# Altium schematic sheet COMSXXXX_Beacon_Rework.SchDoc: BLUEsat Beacon
size A3; Author: Daniel Jedrychowski; Engineer: D. JEDRYCHOWSKI; Organization: BLUEsat Project; Address1: Room 419; Address2: School of EE&T; Address3: UNSW, NSW 2052; Address4: Australia; DocumentNumber: COMS0001; SheetNumber: 1; SheetTotal: 1; Description: Morse code continuous wave beacon based on EPROM; Version: 1.1
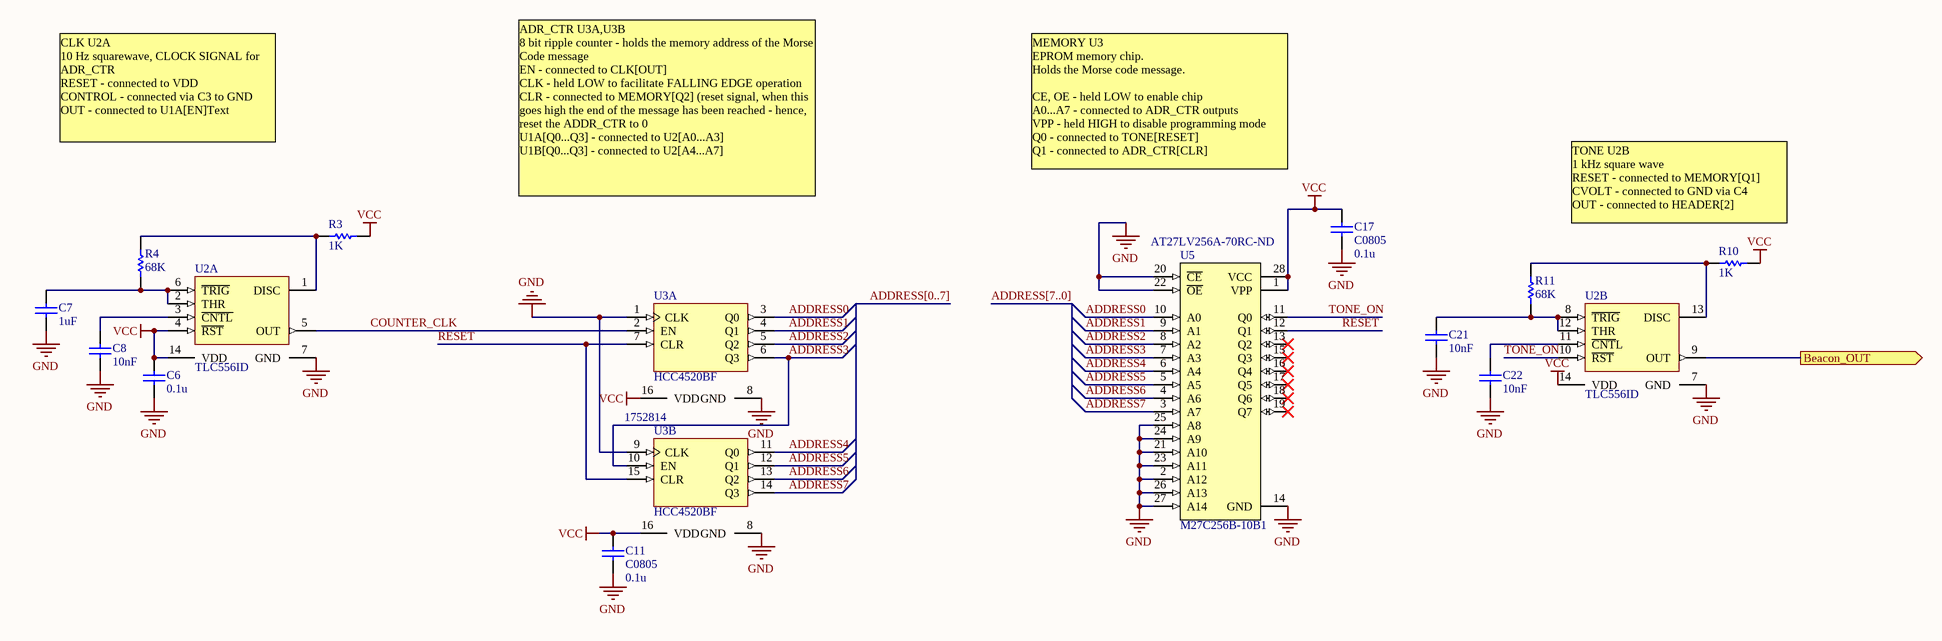
[diagram p0: COMSXXXX_Beacon_Rework.SchDoc]

## Parts
C6  value 0.1u  [CAPC2012M]  (hidden comment: C0805)
C7  value 1uF  [CAPC2012M]  (hidden comment: Cap1u)
C8  value 10nF  [CAPC2012M]  (hidden comment: Cap)
C11  C0805  value 0.1u  [CAPC2012M]
C17  C0805  value 0.1u  [CAPC2012M]
C21  value 10nF  [CAPC2012M]  (hidden comment: Cap)
C22  value 10nF  [CAPC2012M]  (hidden comment: Cap)
R3  value 1K  [RESC2012M]  (hidden comment: Res2)
R4  value 68K  [RESC2012M]  (hidden comment: Res1)
R10  value 1K  [RESC2012M]  (hidden comment: Res2)
R11  value 68K  [RESC2012M]  (hidden comment: Res1)
U2  TLC556ID  [D014_N]  (parts A,B of 2)
U3  HCC4520BF  [SOIC16_M]  (parts A,B of 2)
U5  M27C256B-10B1  Supplier Part Number 1: AT27LV256A-70RC-ND  [SOIC127P1199-28AM]

## Ports
Beacon_OUT (out)

## Nets
GND: C6.1 C7.2 C8.2 C11.1 C17.1 C21.2 C22.2 U2.7(GND) U3.1(CLK) U3.8(GND) U3.9(CLK) U5.2(A12) U5.14(GND) U5.20(~{CE}) U5.21(A10) U5.22(~{OE}) U5.23(A11) U5.24(A9) U5.25(A8) U5.26(A13) U5.27(A14)
VCC: C6.2 C11.2 C17.2 R3.1 R10.1 U2.4(~{RST}) U2.14(VDD) U3.16(VDD) U5.1(VPP) U5.28(VCC)
ADDRESS0: U3.3(Q0) U5.10(A0)
ADDRESS1: U3.4(Q1) U5.9(A1)
ADDRESS2: U3.5(Q2) U5.8(A2)
ADDRESS3: U3.6(Q3) U3.10(EN) U5.7(A3)
ADDRESS4: U3.11(Q0) U5.6(A4)
ADDRESS5: U3.12(Q1) U5.5(A5)
ADDRESS6: U3.13(Q2) U5.4(A6)
ADDRESS7: U3.14(Q3) U5.3(A7)
Beacon_OUT: U2.9(OUT) ; port Beacon_OUT
COUNTER_CLK: U2.5(OUT) U3.2(EN)
RESET: U3.7(CLR) U3.15(CLR) U5.12(Q1)
TONE_ON: U2.10(~{RST}) U5.11(Q0)
NetC7_1: C7.1 R4.1 U2.2(THR) U2.6(~{TRIG})
NetC8_1: C8.1 U2.3(~{CNTL})
NetC21_1: C21.1 R11.2 U2.8(~{TRIG}) U2.12(THR)
NetC22_1: C22.1 U2.11(~{CNT}L)
NetR3_2: R3.2 R4.2 U2.1(DISC)
NetR10_2: R10.2 R11.1 U2.13(DISC)

Not connected (* = marked no-connect by the designer): U5 13(Q2)* 15(Q3)* 16(Q4)* 17(Q5)* 18(Q6)* 19(Q7)*

## Buses and harness runs
bus ADDRESS[0..7]
bus ADDRESS[7..0]

## Notes on the sheet
- CLK U2A
  10 Hz squarewave, CLOCK SIGNAL for ADR_CTR
  RESET - connected to VDD
  CONTROL - connected via C3 to GND
  OUT - connected to U1A[EN]Text
- MEMORY U3
  EPROM memory chip.
  Holds the Morse code message.
  CE, OE - held LOW to enable chip
  A0...A7 - connected to ADR_CTR outputs
  VPP - held HIGH to disable programming mode
  Q0 - connected to TONE[RESET]
  Q1 - connected to ADR_CTR[CLR]
- ADR_CTR U3A,U3B
  8 bit ripple counter - holds the memory address of the Morse Code message
  EN - connected to CLK[OUT]
  CLK - held LOW to facilitate FALLING EDGE operation
  CLR - connected to MEMORY[Q2] (reset signal, when this goes high the end of the message has been reached - hence, reset the ADDR_CTR to 0
  U1A[Q0...Q3] - connected to U2[A0...A3]
  U1B[Q0...Q3] - connected to U2[A4...A7]
- (near R10) TONE U2B
  1 kHz square wave
  RESET - connected to MEMORY[Q1]
  CVOLT - connected to GND via C4
  OUT - connected to HEADER[2]
- Title
- Description:
- Size:
- Author:
- Date:
- A3
- Time:
- Version
- Sheet:
- Drawing No.:
- of
- File:

## Library data of the parts
C6-C8 C11 C17 C21 C22 = Cap: Capacitor; Published: 8-Jun-2000; LatestRevisionDate: 17-Jul-2002; LatestRevisionNote: Re-released for DXP Platform.; PackageReference: RAD-0.3; Publisher: Altium Limited; Supplier 1: Farnell
  C6 C11 C17: Supplier Part Number 1: 1650866
  C7: Supplier Part Number 1: 1637035
  C8 C21 C22: Supplier Part Number 1: 9406352
R3 R4 R10 R11 = Res1: Resistor; Published: 8-Jun-2000; LatestRevisionDate: 17-Jul-2002; LatestRevisionNote: Re-released for DXP Platform.; PackageReference: AXIAL-0.3; Publisher: Altium Limited; Supplier 1: Farnell
  R3 R10: Supplier Part Number 1: 1500663
  R4 R11: Supplier Part Number 1: 9234233
U2 = TLC556ID: Dual LinCMOS Timer; Published: 15-Apr-2002; LatestRevisionDate: 13-Apr-2006; LatestRevisionNote: IPC-7351 Footprint Added.; DatasheetVersion: Oct-1988; PackageVersion: Jan-1998; PackageReference: D014; Publisher: Altium Limited; PackageDescription: 14-Pin Small Outline Integrated Circuit 1.27 mm Pitch; Code_IPC: SOIC127P600-14; ComponentLink1Description: Manufacturer Link; ComponentLink1URL: http://www.ti.com/; ComponentLink2Description: Datasheet; ComponentLink2URL: http://www-s.ti.com/sc/ds/tlc556.pdf
U3 = HCC4520BF: Dual Binary Up-Counter; Published: 8-Jun-2000; LatestRevisionDate: 06-Jun-2005; LatestRevisionNote: Stylized 3D Model Added.; DatasheetVersion: Jun-1989; PackageVersion: Apr-1996; PackageReference: DIP16; Publisher: Altium Limited; PackageDescription: DIP; 16 Leads; Row Spacing 7.62 mm; Pitch 2.54 mm; ComponentLink1Description: Manufacturer Link; ComponentLink1URL: http://www.st.com/; Supplier 1: Farnell; Supplier Part Number 1: 1752814; Supplier 2: Farnell
U5 = M27C256B-10B1: 256 Kbit (32Kb X 8) UV EPROM and OTP EPROM; Published: 24-Aug-2001; LatestRevisionDate: 06-Jun-2005; LatestRevisionNote: Stylized 3D Model Added.; DatasheetVersion: Jul-1998; PackageVersion: Jan-2003; PackageReference: PDIP28; Publisher: Altium Limited; PackageDescription: DIP; 28 Leads; Row Spacing 15.24 mm; Pitch 2.54 mm; ComponentLink1Description: Manufacturer Link; ComponentLink1URL: http://www.st.com/; ComponentLink2Description: Datasheet; ComponentLink2URL: http://www.st.com/stonline/products/literature/ds/2384/m27c256b.pdf; Supplier 1: Digi-Key